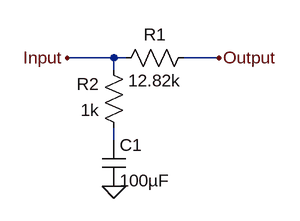
[diagram p0: schematic feedback_system.asc]
feedback_system.asc, the LTspice schematic file:
Version 4
SHEET 1 880 680
WIRE 144 144 80 144
WIRE 160 144 144 144
WIRE 288 144 240 144
WIRE 144 160 144 144
WIRE 144 256 144 240
FLAG 144 320 0
FLAG 288 144 Output
FLAG 80 144 Input
SYMBOL res 256 128 R90
WINDOW 0 0 56 VBottom 2
WINDOW 3 32 56 VTop 2
SYMATTR InstName R1
SYMATTR Value 12.82k
SYMBOL res 160 256 R180
WINDOW 0 36 76 Left 2
WINDOW 3 36 40 Left 2
SYMATTR InstName R2
SYMATTR Value 1k
SYMBOL cap 128 256 R0
SYMATTR InstName C1
SYMATTR Value 100µF

The netlist it stands for:
* feedback_system.asc
R1 Output Input 12.82k
R2 N001 Input 1k
C1 N001 0 100µF
.backanno
.end